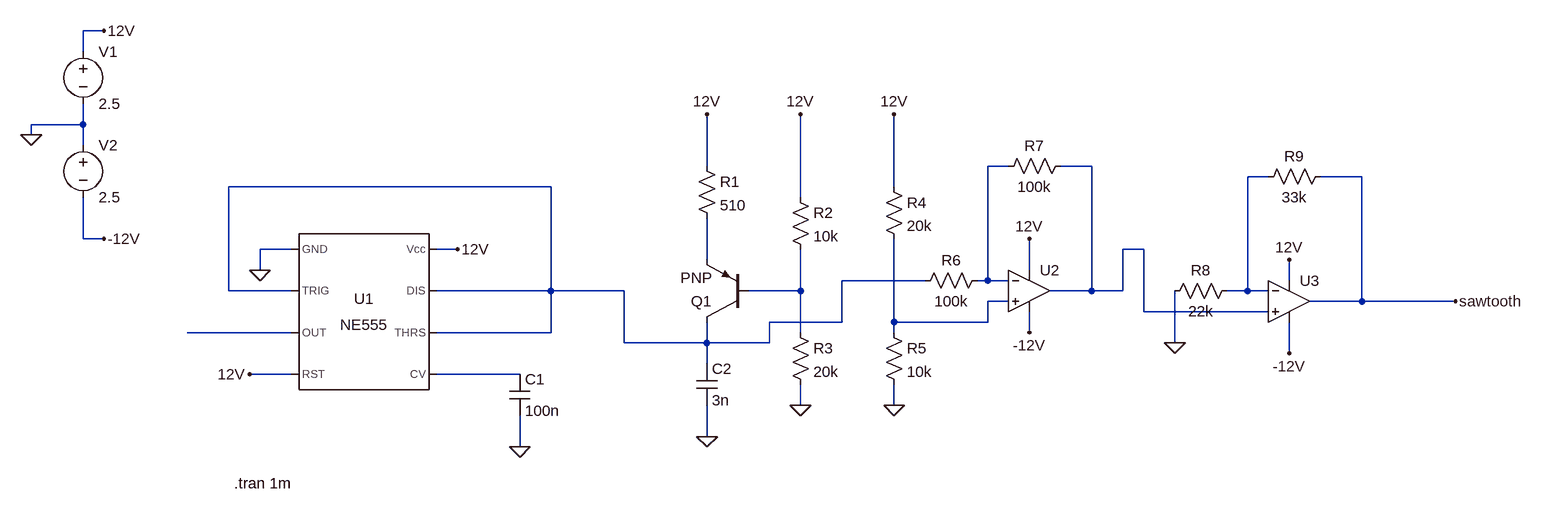
[diagram p0: schematic Draft1.asc]
Draft1.asc, the LTspice schematic file:
Version 4
SHEET 1 1788 680
WIRE -416 -400 -448 -400
WIRE -448 -368 -448 -400
WIRE -448 -256 -448 -288
WIRE -448 -256 -528 -256
WIRE -528 -240 -528 -256
WIRE -448 -224 -448 -256
WIRE 512 -192 512 -272
WIRE 976 -192 944 -192
WIRE 1104 -192 1056 -192
WIRE 1376 -176 1344 -176
WIRE 1520 -176 1456 -176
WIRE 272 -160 -224 -160
WIRE 800 -160 800 -272
WIRE 656 -144 656 -272
WIRE -448 -80 -448 -144
WIRE -416 -80 -448 -80
WIRE -128 -64 -176 -64
WIRE 128 -64 96 -64
WIRE 1184 -64 1152 -64
WIRE 512 -48 512 -112
WIRE -176 -32 -176 -64
WIRE 1008 -32 1008 -80
WIRE 848 -16 720 -16
WIRE 944 -16 944 -192
WIRE 944 -16 928 -16
WIRE 976 -16 944 -16
WIRE 1408 -16 1408 -48
WIRE -224 0 -224 -160
WIRE -128 0 -224 0
WIRE 272 0 272 -160
WIRE 272 0 96 0
WIRE 384 0 272 0
WIRE 656 0 656 -64
WIRE 656 0 576 0
WIRE 1104 0 1104 -192
WIRE 1104 0 1040 0
WIRE 1152 0 1152 -64
WIRE 1152 0 1104 0
WIRE 1344 0 1344 -176
WIRE 1344 0 1312 0
WIRE 1376 0 1344 0
WIRE 976 16 944 16
WIRE 1520 16 1520 -176
WIRE 1520 16 1440 16
WIRE 1664 16 1520 16
WIRE 1184 32 1184 -64
WIRE 1376 32 1184 32
WIRE 720 48 720 -16
WIRE 720 48 608 48
WIRE 800 48 800 -80
WIRE 944 48 944 16
WIRE 944 48 800 48
WIRE -128 64 -288 64
WIRE 272 64 272 0
WIRE 272 64 96 64
WIRE 656 64 656 0
WIRE 800 64 800 48
WIRE 1008 64 1008 32
WIRE 384 80 384 0
WIRE 512 80 512 48
WIRE 512 80 384 80
WIRE 608 80 608 48
WIRE 608 80 512 80
WIRE 1232 80 1232 0
WIRE 1408 96 1408 48
WIRE 512 112 512 80
WIRE -128 128 -192 128
WIRE 224 128 96 128
WIRE 656 176 656 144
WIRE 800 176 800 144
WIRE 512 224 512 176
WIRE 224 240 224 192
FLAG -176 -32 0
FLAG 224 240 0
FLAG -416 -400 12V
FLAG -192 128 12V
FLAG 128 -64 12V
FLAG 512 224 0
FLAG 512 -272 12V
FLAG 656 176 0
FLAG 656 -272 12V
FLAG 800 176 0
FLAG 800 -272 12V
FLAG 1008 -80 12V
FLAG -528 -240 0
FLAG -416 -80 -12V
FLAG 1008 64 -12V
FLAG 1408 -48 12V
FLAG 1408 96 -12V
FLAG 1232 80 0
FLAG 1664 16 sawtooth
SYMBOL Misc\\NE555 -16 32 R0
SYMATTR InstName U1
SYMBOL cap 208 128 R0
SYMATTR InstName C1
SYMATTR Value 100n
SYMBOL voltage -448 -384 R0
WINDOW 123 0 0 Left 0
WINDOW 39 0 0 Left 0
SYMATTR InstName V1
SYMATTR Value 2.5
SYMBOL res 496 -208 R0
SYMATTR InstName R1
SYMATTR Value 510
SYMBOL cap 496 112 R0
SYMATTR InstName C2
SYMATTR Value 3n
SYMBOL pnp 576 48 R180
SYMATTR InstName Q1
SYMBOL res 640 -160 R0
SYMATTR InstName R2
SYMATTR Value 10k
SYMBOL res 640 48 R0
SYMATTR InstName R3
SYMATTR Value 20k
SYMBOL OpAmps\\UniversalOpAmp1 1008 0 R0
SYMATTR InstName U2
SYMBOL res 784 -176 R0
SYMATTR InstName R4
SYMATTR Value 20k
SYMBOL res 784 48 R0
SYMATTR InstName R5
SYMATTR Value 10k
SYMBOL res 944 -32 R90
WINDOW 0 0 56 VBottom 2
WINDOW 3 32 56 VTop 2
SYMATTR InstName R6
SYMATTR Value 100k
SYMBOL res 1072 -208 R90
WINDOW 0 0 56 VBottom 2
WINDOW 3 32 56 VTop 2
SYMATTR InstName R7
SYMATTR Value 100k
SYMBOL voltage -448 -240 R0
WINDOW 123 0 0 Left 0
WINDOW 39 0 0 Left 0
SYMATTR InstName V2
SYMATTR Value 2.5
SYMBOL res 1328 -16 R90
WINDOW 0 0 56 VBottom 2
WINDOW 3 32 56 VTop 2
SYMATTR InstName R8
SYMATTR Value 22k
SYMBOL OpAmps\\UniversalOpAmp1 1408 16 R0
SYMATTR InstName U3
SYMBOL res 1472 -192 R90
WINDOW 0 0 56 VBottom 2
WINDOW 3 32 56 VTop 2
SYMATTR InstName R9
SYMATTR Value 33k
TEXT -216 296 Left 2 !.tran 1m

The netlist it stands for:
* Draft1.asc
XU1 0 N004 N008 12V N009 N004 N004 12V NE555  ; pins GND TRIG OUT RST CV THRS DIS Vcc
C1 N009 0 100n
V1 12V 0 2.5
R1 12V N005 510
C2 N004 0 3n
Q1 N004 N006 N005 0 PNP
R2 12V N006 10k
R3 N006 0 20k
XU2 N007 N001 12V -12V N002 level1 Avol=1Meg GBW=10Meg Vos=0 En=0 Enk=0 In=0 Ink=0 Rin=500Meg  ; pins In+ In- V+ V- OUT
R4 12V N007 20k
R5 N007 0 10k
R6 N001 N004 100k
R7 N002 N001 100k
V2 0 -12V 2.5
R8 N003 0 22k
XU3 N002 N003 12V -12V sawtooth level1 Avol=1Meg GBW=10Meg Vos=0 En=0 Enk=0 In=0 Ink=0 Rin=500Meg  ; pins In+ In- V+ V- OUT
R9 sawtooth N003 33k
.model NPN NPN
.model PNP PNP
.lib standard.bjt
.tran 1m
.lib NE555.sub
.lib UniversalOpAmp1.lib
.backanno
.end